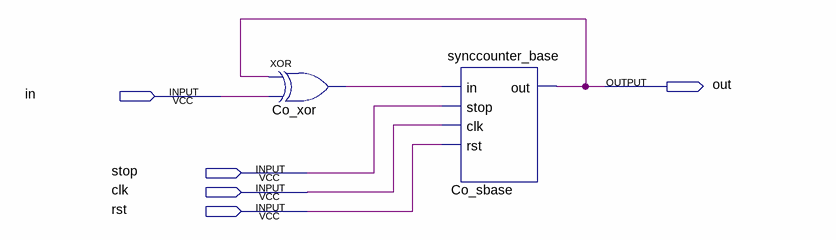
[diagram p0: schematic sheet]
// Quartus schematic synccounter_basenext.bdf as structural Verilog: 2 symbols, 5 pins
module synccounter_basenext (
  input  in,
  input  stop,
  input  clk,
  input  rst,
  output out
);

  wire Co_xor_out;

  xor Co_xor (Co_xor_out, out, in);
  synccounter_base Co_sbase (.in(Co_xor_out), .stop(stop), .clk(clk), .rst(rst), .out(out));
endmodule
